# Altium schematic sheet spi_flash.SchDoc
size A4
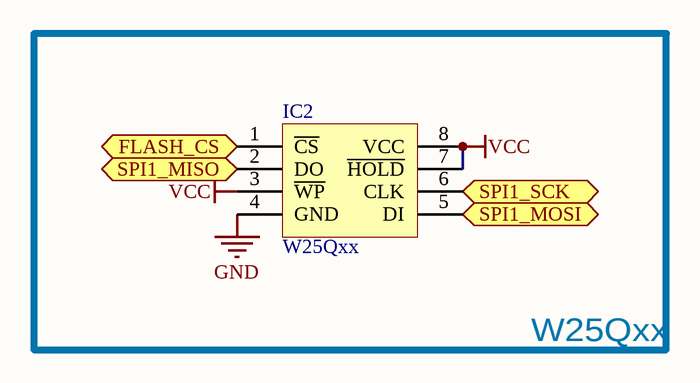
[diagram p0: spi_flash.SchDoc]

## Parts
IC2  W25Qxx  [SOP8W_N]

## Blocks framed on the sheet
W25Qxx: IC2

## Ports
FLASH_CS (bidir), SPI1_MISO (bidir), SPI1_MOSI (bidir), SPI1_SCK (bidir)

## Nets
GND: IC2.4(GND)
VCC: IC2.3(~{WP}) IC2.7(~{HOLD}) IC2.8(VCC)
FLASH_CS: IC2.1(~{CS}) ; port FLASH_CS
SPI1_MISO: IC2.2(DO) ; port SPI1_MISO
SPI1_MOSI: IC2.5(DI) ; port SPI1_MOSI
SPI1_SCK: IC2.6(CLK) ; port SPI1_SCK

## Library data of the parts
IC2 = W25Qxx: 外置Flash; 版权归属: 源创客; BOM名称: 外置Flash; 学习资源: www.ooocke.com